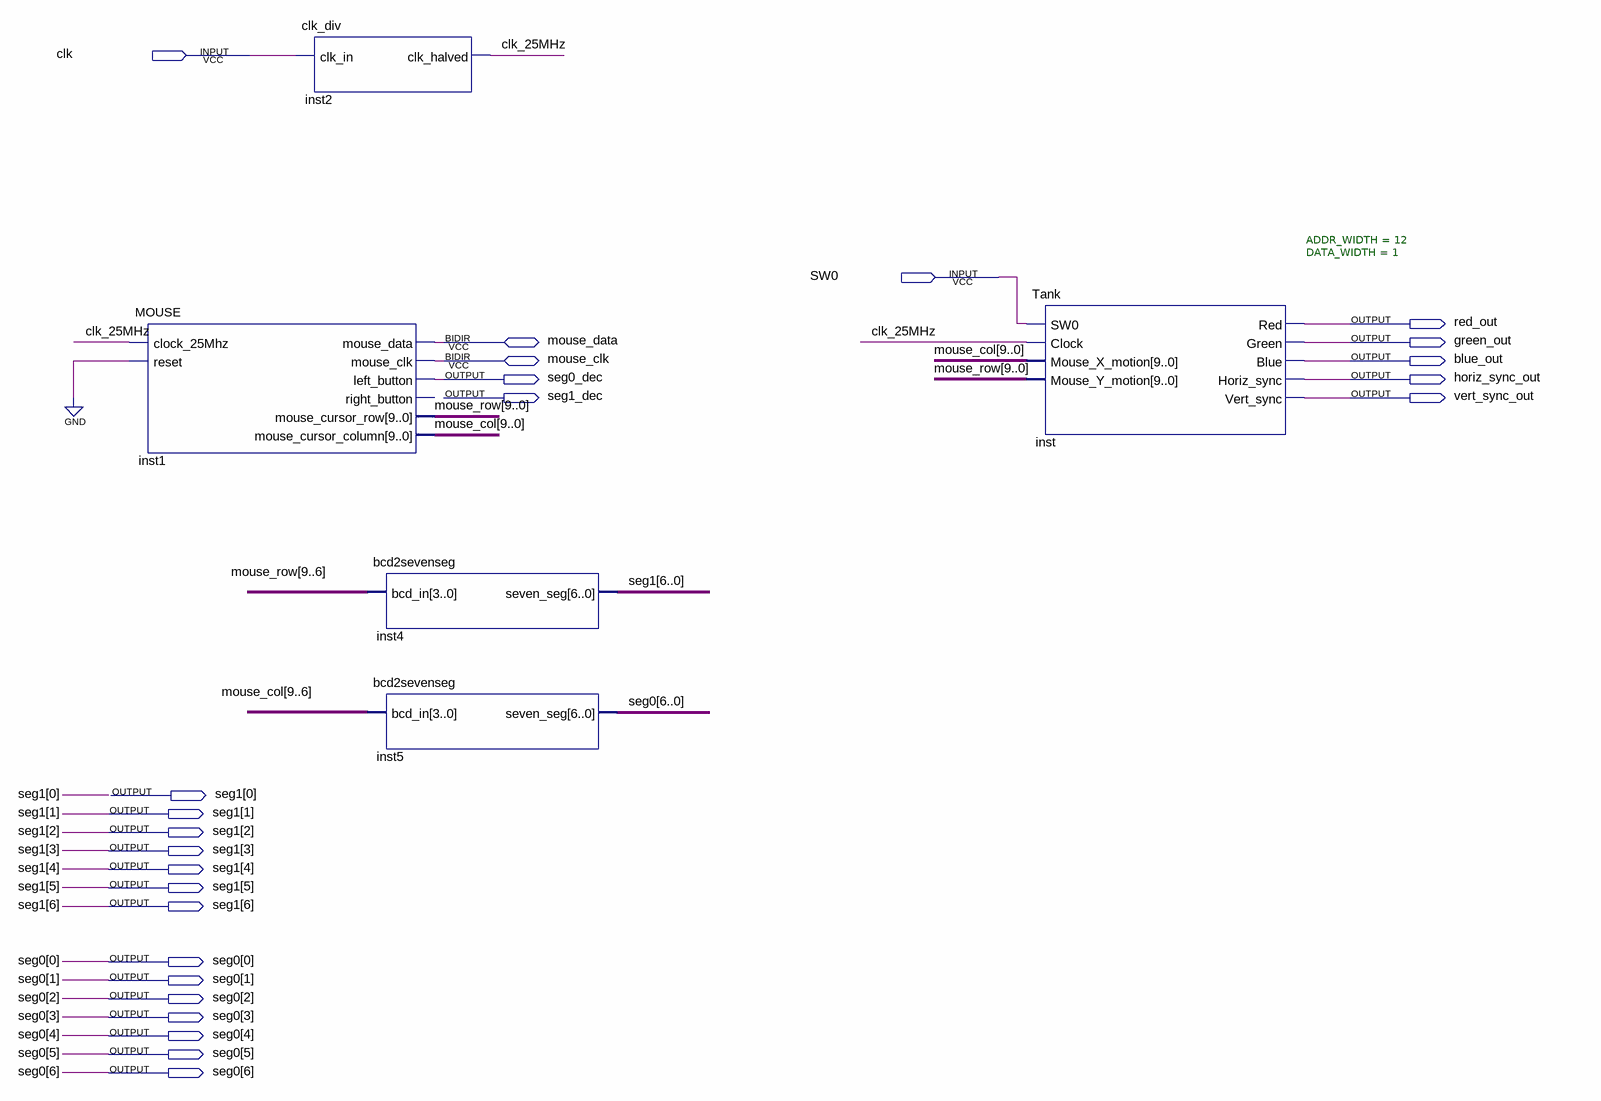
[diagram p0: schematic sheet]
// Quartus schematic Player_Tank.bdf as structural Verilog: 5 symbols, 25 pins
module Player_Tank (
  input  clk,
  input  SW0,
  inout  mouse_data,
  inout  mouse_clk,
  output red_out,
  output green_out,
  output blue_out,
  output seg0_dec,
  output horiz_sync_out,
  output seg1_dec,
  output vert_sync_out,
  output [6:0] seg1,
  output [6:0] seg0
);

  wire clk_25MHz;
  wire [9:0] mouse_col, mouse_row;

  MOUSE inst1 (
    .clock_25Mhz(clk_25MHz), .reset(1'b0), .left_button(seg0_dec), .mouse_cursor_row(mouse_row),
    .mouse_cursor_column(mouse_col), .mouse_data(mouse_data), .mouse_clk(mouse_clk));  // open: right_button
  clk_div inst2 (.clk_in(clk), .clk_halved(clk_25MHz));
  bcd2sevenseg inst4 (.bcd_in(mouse_row[9:6]), .seven_seg(seg1));
  bcd2sevenseg inst5 (.bcd_in(mouse_col[9:6]), .seven_seg(seg0));
  Tank #(.ADDR_WIDTH(12), .DATA_WIDTH(1)) inst (
    .SW0(SW0), .Clock(clk_25MHz), .Mouse_X_motion(mouse_col), .Mouse_Y_motion(mouse_row), .Red(red_out),
    .Green(green_out), .Blue(blue_out), .Horiz_sync(horiz_sync_out), .Vert_sync(vert_sync_out));
endmodule
